# EAGLE design 608_donkey_030000 (EAGLE 9.6.2)
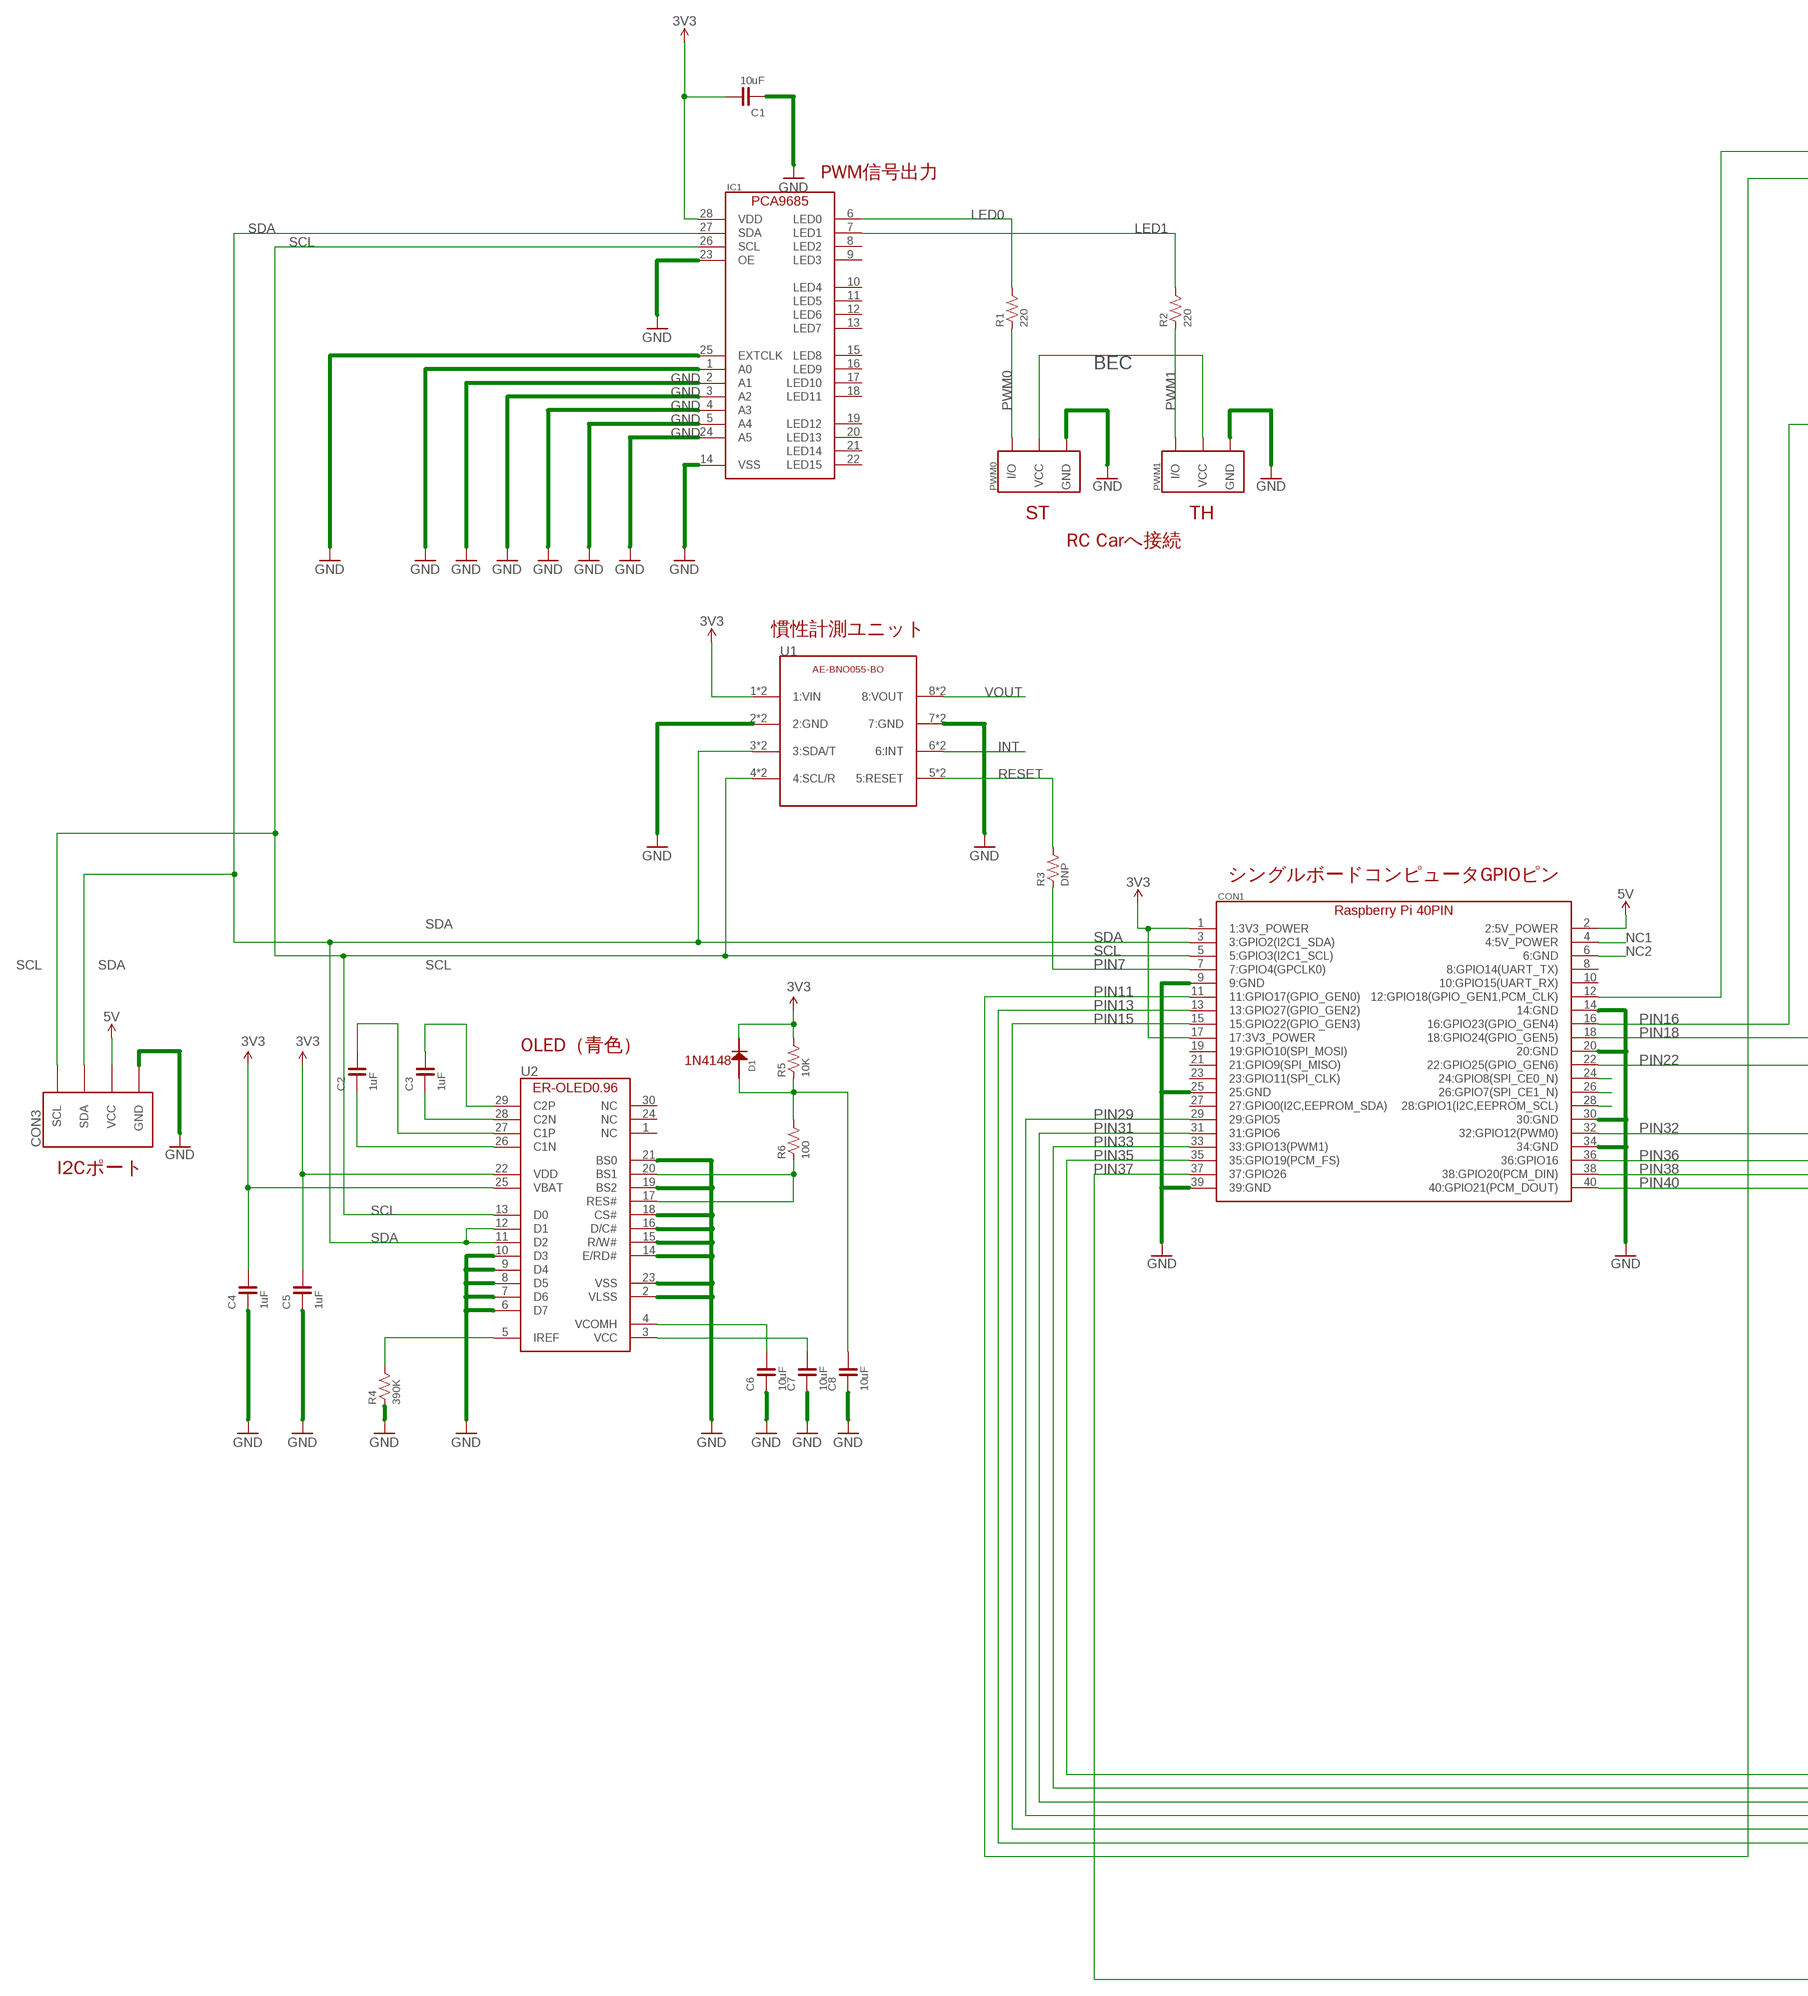
[diagram p0: schematic, sheet 1, part 1 of 3]
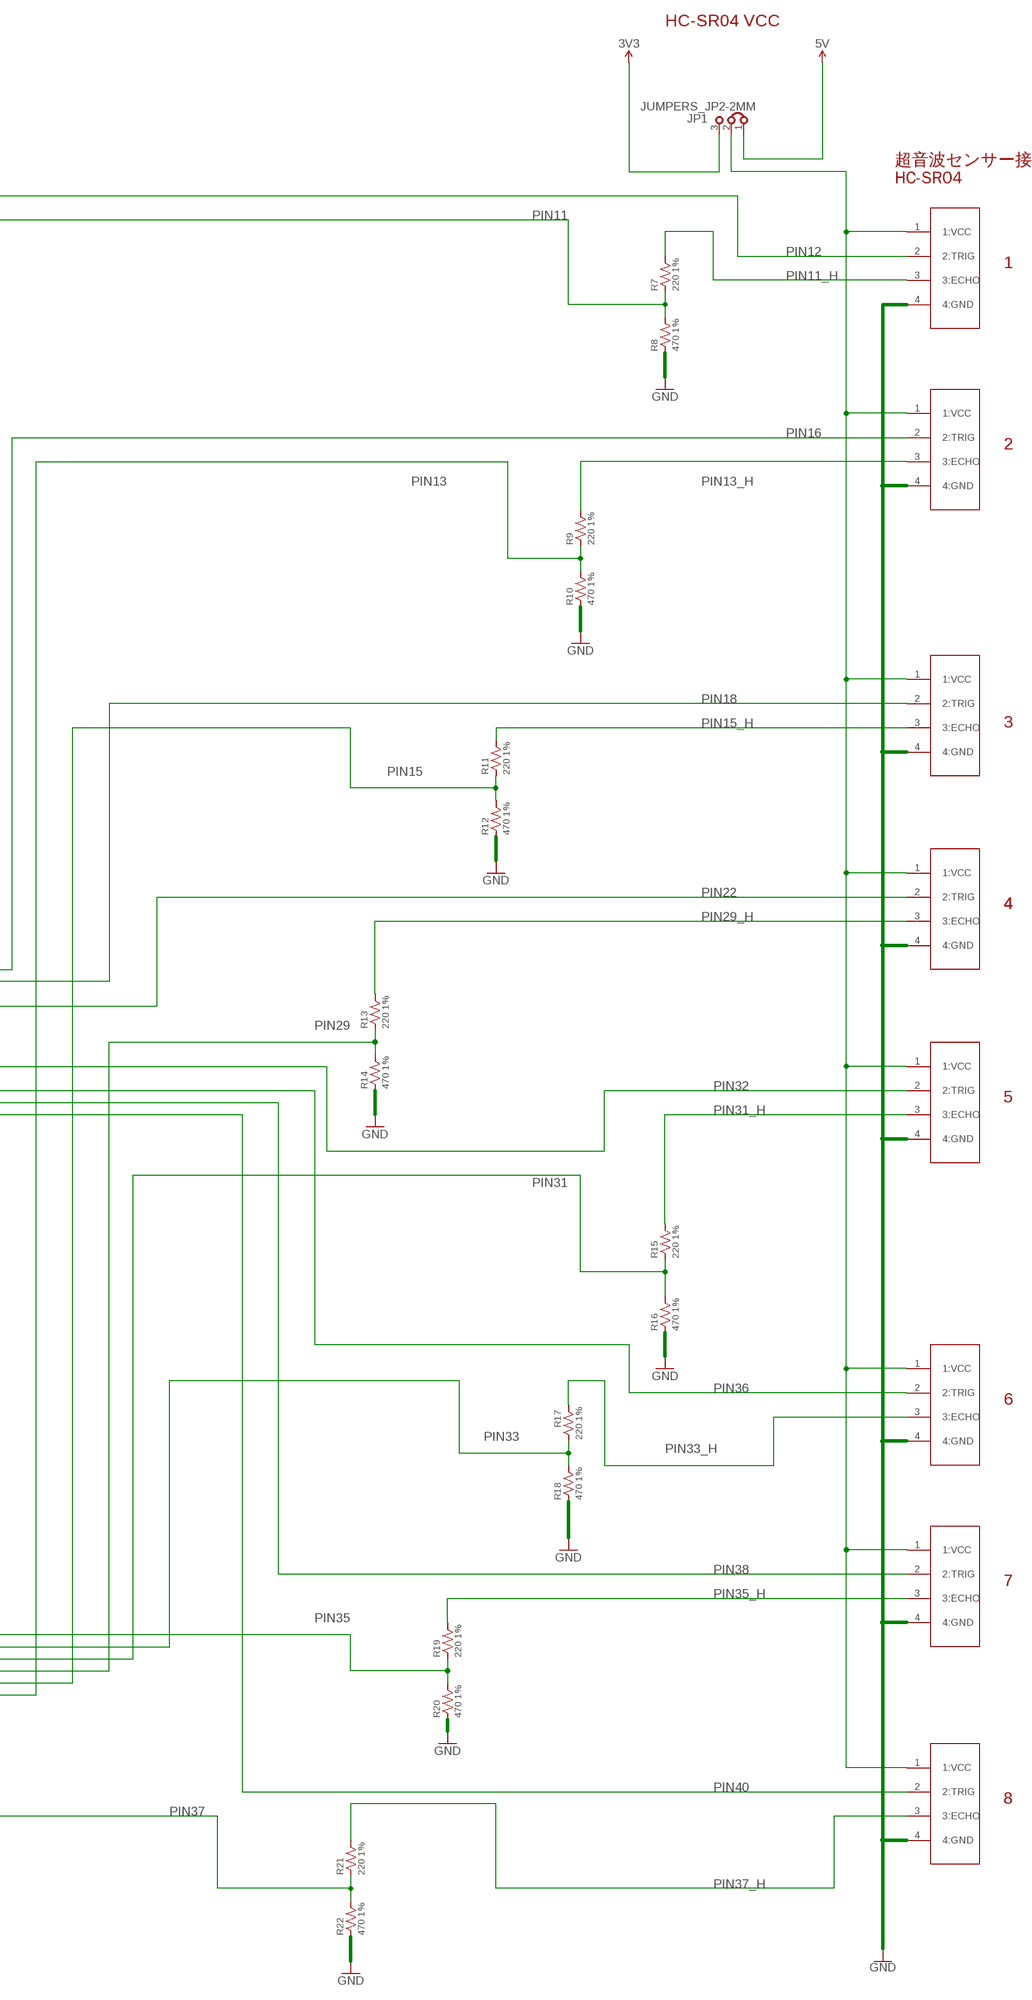
[diagram p1: schematic, sheet 1, part 2 of 3]
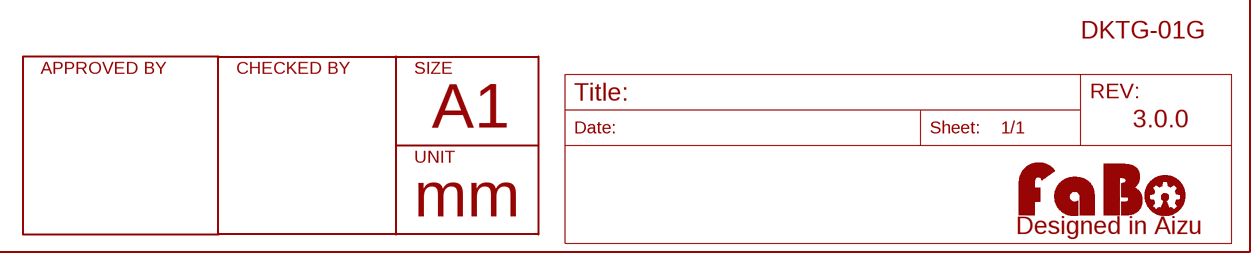
[diagram p2: schematic, sheet 1, part 3 of 3]

## Parts
C1  10uF  CAPACITOR-0603  [0603]
C2  1uF  CAPACITOR-0603-BOTTOM  [0603-BOTTOM]
C3  1uF  CAPACITOR-0603-BOTTOM  [0603-BOTTOM]
C4  1uF  CAPACITOR-0603-BOTTOM  [0603-BOTTOM]
C5  1uF  CAPACITOR-0603-BOTTOM  [0603-BOTTOM]
C6  10uF  CAPACITOR-0603-BOTTOM  [0603-BOTTOM]
C7  10uF  CAPACITOR-0603-BOTTOM  [0603-BOTTOM]
C8  10uF  CAPACITOR-0603-BOTTOM  [0603-BOTTOM]
CON1  RASPBERRYPI_SHEILD  [RASPBERRY_PI_SHILED]
CON3  FABO_BRICK_I2C-S04B-PASK-2  [FABO_BRICK_I2C_S04B-PASK-2]
D1  1N4148  [1N4148W]
HC1  HC-SR04CONHS-SR04CON-SPEACING  [HC-SR04CON-SPEACE]
HC2  HC-SR04CONHS-SR04CON-SPEACING  [HC-SR04CON-SPEACE]
HC3  HC-SR04CONHS-SR04CON-SPEACING  [HC-SR04CON-SPEACE]
HC4  HC-SR04CONHS-SR04CON-SPEACING  [HC-SR04CON-SPEACE]
HC5  HC-SR04CONHS-SR04CON-SPEACING  [HC-SR04CON-SPEACE]
HC6  HC-SR04CONHS-SR04CON-SPEACING  [HC-SR04CON-SPEACE]
HC7  HC-SR04CONHS-SR04CON-SPEACING  [HC-SR04CON-SPEACE]
HC8  HC-SR04CONHS-SR04CON-SPEACING  [HC-SR04CON-SPEACE]
IC1  PCA9685BS  [PCA9685]
JP1  JUMPERS_JP2-2MM  [JUMPERS_JP2-2MM]
LOGO1  LOGO_FABO-M  [LOGO_FABO_M]
PWM0  PWM0  FABO-BRICK-3PIN_HEADER  [PIN_1X3_NARROW]
PWM1  PWM1  FABO-BRICK-3PIN_HEADER  [PIN_1X3_NARROW]
R1  220  RESISTOR-0603  [0603]
R2  220  RESISTOR-0603  [0603]
R3  DNP  RESISTOR-0603-BOTTOM  [0603-BOTTOM]
R4  390K  RESISTOR-0603-BOTTOM  [0603-BOTTOM]
R5  10K  RESISTOR-0603-BOTTOM  [0603-BOTTOM]
R6  100  RESISTOR-0603-BOTTOM  [0603-BOTTOM]
R7  220 1%  RESISTOR-0603  [0603]
R8  470 1%  RESISTOR-0603  [0603]
R9  220 1%  RESISTOR-0603  [0603]
R10  470 1%  RESISTOR-0603  [0603]
R11  220 1%  RESISTOR-0603  [0603]
R12  470 1%  RESISTOR-0603  [0603]
R13  220 1%  RESISTOR-0603  [0603]
R14  470 1%  RESISTOR-0603  [0603]
R15  220 1%  RESISTOR-0603  [0603]
R16  470 1%  RESISTOR-0603  [0603]
R17  220 1%  RESISTOR-0603  [0603]
R18  470 1%  RESISTOR-0603  [0603]
R19  220 1%  RESISTOR-0603  [0603]
R20  470 1%  RESISTOR-0603  [0603]
R21  220 1%  RESISTOR-0603  [0603]
R22  470 1%  RESISTOR-0603  [0603]
U1  AE-BNO055-BO  [DIP_8]
U2  ER-OLED0.96-1ER-CON30HT-1_REV2  [ER-CON30HT-1_REV2]

## Nets
3V3: C1.2 C4.2 C5.2 CON1.1(1:3V3_POWER) CON1.17(17:3V3_POWER) D1.CATHODE IC1.28(VDD) JP1.3 R5.2 U1.1(1:VIN) U1.1-1(1:VIN) U2.22(VDD) U2.25(VBAT)
5V: CON1.2(2:5V_POWER) CON3.VCC JP1.1
BEC: PWM0.2(VCC) PWM1.2(VCC)
GND: C1.1 C4.1 C5.1 C6.1 C7.1 C8.1 CON1.9(9:GND) CON1.14(14:GND) CON1.20(20:GND) CON1.25(25:GND) CON1.30(30:GND) CON1.34(34:GND) CON1.39(39:GND) CON3.GND HC1.4(4:GND) HC2.4(4:GND) HC3.4(4:GND) HC4.4(4:GND) HC5.4(4:GND) HC6.4(4:GND) HC7.4(4:GND) HC8.4(4:GND) IC1.1(A0) IC1.2(A1) IC1.3(A2) IC1.4(A3) IC1.5(A4) IC1.14(VSS) IC1.23(OE) IC1.24(A5) IC1.25(EXTCLK) PWM0.3(GND) PWM1.3(GND) R4.1 R8.1 R10.1 R12.1 R14.1 R16.1 R18.1 R20.1 R22.1 U1.2(2:GND) U1.2-1(2:GND) U1.7(7:GND) U1.7-1(7:GND) U2.2(VLSS) U2.6(D7) U2.7(D6) U2.8(D5) U2.9(D4) U2.10(D3) U2.14(E/RD#) U2.15(R/W#) U2.16(D/C#) U2.18(CS#) U2.19(BS2) U2.21(BS0) U2.23(VSS)
INT: U1.6(6:INT) U1.6-1(6:INT)
LED0: IC1.6(LED0) R1.2
LED1: IC1.7(LED1) R2.2
N$7: C2.1 U2.26(C1N)
N$14: C2.2 U2.27(C1P)
N$19: C3.1 U2.28(C2N)
N$21: C3.2 U2.29(C2P)
N$23: R4.2 U2.5(IREF)
N$24: C6.2 U2.4(VCOMH)
N$25: C7.2 U2.3(VCC)
N$26: R6.1 U2.17(RES#) U2.20(BS1)
N$27: C8.2 D1.ANODE R5.1 R6.2
N$63: CON1.24(24:GPIO8(SPI_CE0_N))
N$65: CON1.26(26:GPIO7(SPI_CE1_N))
N$68: CON1.28(28:GPIO1(I2C,EEPROM_SCL))
NC1: CON1.4(4:5V_POWER)
NC2: CON1.6(6:GND)
PIN7: CON1.7(7:GPIO4(GPCLK0)) R3.1
PIN11: CON1.11(11:GPIO17(GPIO_GEN0)) R7.1 R8.2
PIN11_H: HC1.3(3:ECHO) R7.2
PIN12: CON1.12(12:GPIO18(GPIO_GEN1,PCM_CLK)) HC1.2(2:TRIG)
PIN13: CON1.13(13:GPIO27(GPIO_GEN2)) R9.1 R10.2
PIN13_H: HC2.3(3:ECHO) R9.2
PIN15: CON1.15(15:GPIO22(GPIO_GEN3)) R11.1 R12.2
PIN15_H: HC3.3(3:ECHO) R11.2
PIN16: CON1.16(16:GPIO23(GPIO_GEN4)) HC2.2(2:TRIG)
PIN18: CON1.18(18:GPIO24(GPIO_GEN5)) HC3.2(2:TRIG)
PIN22: CON1.22(22:GPIO25(GPIO_GEN6)) HC4.2(2:TRIG)
PIN29: CON1.29(29:GPIO5) R13.1 R14.2
PIN29_H: HC4.3(3:ECHO) R13.2
PIN31: CON1.31(31:GPIO6) R15.1 R16.2
PIN31_H: HC5.3(3:ECHO) R15.2
PIN32: CON1.32(32:GPIO12(PWM0)) HC5.2(2:TRIG)
PIN33: CON1.33(33:GPIO13(PWM1)) R17.1 R18.2
PIN33_H: HC6.3(3:ECHO) R17.2
PIN35: CON1.35(35:GPIO19(PCM_FS)) R19.1 R20.2
PIN35_H: HC7.3(3:ECHO) R19.2
PIN36: CON1.36(36:GPIO16) HC6.2(2:TRIG)
PIN37: CON1.37(37:GPIO26) R21.1 R22.2
PIN37_H: HC8.3(3:ECHO) R21.2
PIN38: CON1.38(38:GPIO20(PCM_DIN)) HC7.2(2:TRIG)
PIN40: CON1.40(40:GPIO21(PCM_DOUT)) HC8.2(2:TRIG)
PWM0: PWM0.1(I/O) R1.1
PWM1: PWM1.1(I/O) R2.1
RESET: R3.2 U1.5(5:RESET) U1.5-1(5:RESET)
SCL: CON1.5(5:GPIO3(I2C1_SCL)) CON3.SCL IC1.26(SCL) U1.4(4:SCL/R) U1.4-1(4:SCL/R) U2.13(D0)
SDA: CON1.3(3:GPIO2(I2C1_SDA)) CON3.SDA IC1.27(SDA) U1.3(3:SDA/T) U1.3-1(3:SDA/T) U2.11(D2) U2.12(D1)
TR_VCC: HC1.1(1:VCC) HC2.1(1:VCC) HC3.1(1:VCC) HC4.1(1:VCC) HC5.1(1:VCC) HC6.1(1:VCC) HC7.1(1:VCC) HC8.1(1:VCC) JP1.2
VOUT: U1.8(8:VOUT) U1.8-1(8:VOUT)
Unconnected: CON1.8(8:GPIO14(UART_TX)) CON1.10(10:GPIO15(UART_RX)) CON1.19(19:GPIO10(SPI_MOSI)) CON1.21(21:GPIO9(SPI_MISO)) CON1.23(23:GPIO11(SPI_CLK)) CON1.27(27:GPIO0(I2C,EEPROM_SDA)) IC1.8(LED2) IC1.9(LED3) IC1.10(LED4) IC1.11(LED5) IC1.12(LED6) IC1.13(LED7) IC1.15(LED8) IC1.16(LED9) IC1.17(LED10) IC1.18(LED11) IC1.19(LED12) IC1.20(LED13) IC1.21(LED14) IC1.22(LED15) U2.1(NC) U2.24(NC) U2.30(NC)

## Notes on the sheet
- HC-SR04 VCC
- 超音波センサー接続 1~8
  HC-SR04
- PWM信号出力
- 1
- 2
- ST | TH
- RC Carへ接続
- 慣性計測ユニット
- U1
- 3
- シングルボードコンピュータGPIOピン
- 4 | 4
- OLED（青色）
- 1N4148
- I2Cポート | 5
- 6
- 7
- 8
- DKTG-01G
- 3.0.0

## Library data of the parts
C1-C8 = FaBo-Capacitor:CAPACITOR: CAPACITOR
CON1 = FaBo-Boards:RASPBERRYPI_SHEILD
CON3 = FaBo-Template:FABO_BRICK_I2C: FaBo Brick I2C
D1 = FaBo-Diode:1N4148
HC1-HC8 = FaBo-Connetor:HC-SR04CON
IC1 = FaBo-Motor:PCA9685BS
JP1 = 52101-101-REV-A_v16:JUMPERS_JP2-: Jumper/Bridge
LOGO1 = component:LOGO_FABO
PWM0 PWM1 = component:FABO-BRICK-3PIN
R1-R22 = FaBo-Resistors:RESISTOR: RESISTOR
U1 = FaBo-Connetor:AE-BNO055-BO
U2 = FaBo-Display:ER-OLED0.96-1: ER-CON30HT-1 Rev2 wide distance 0.23mm

## Board
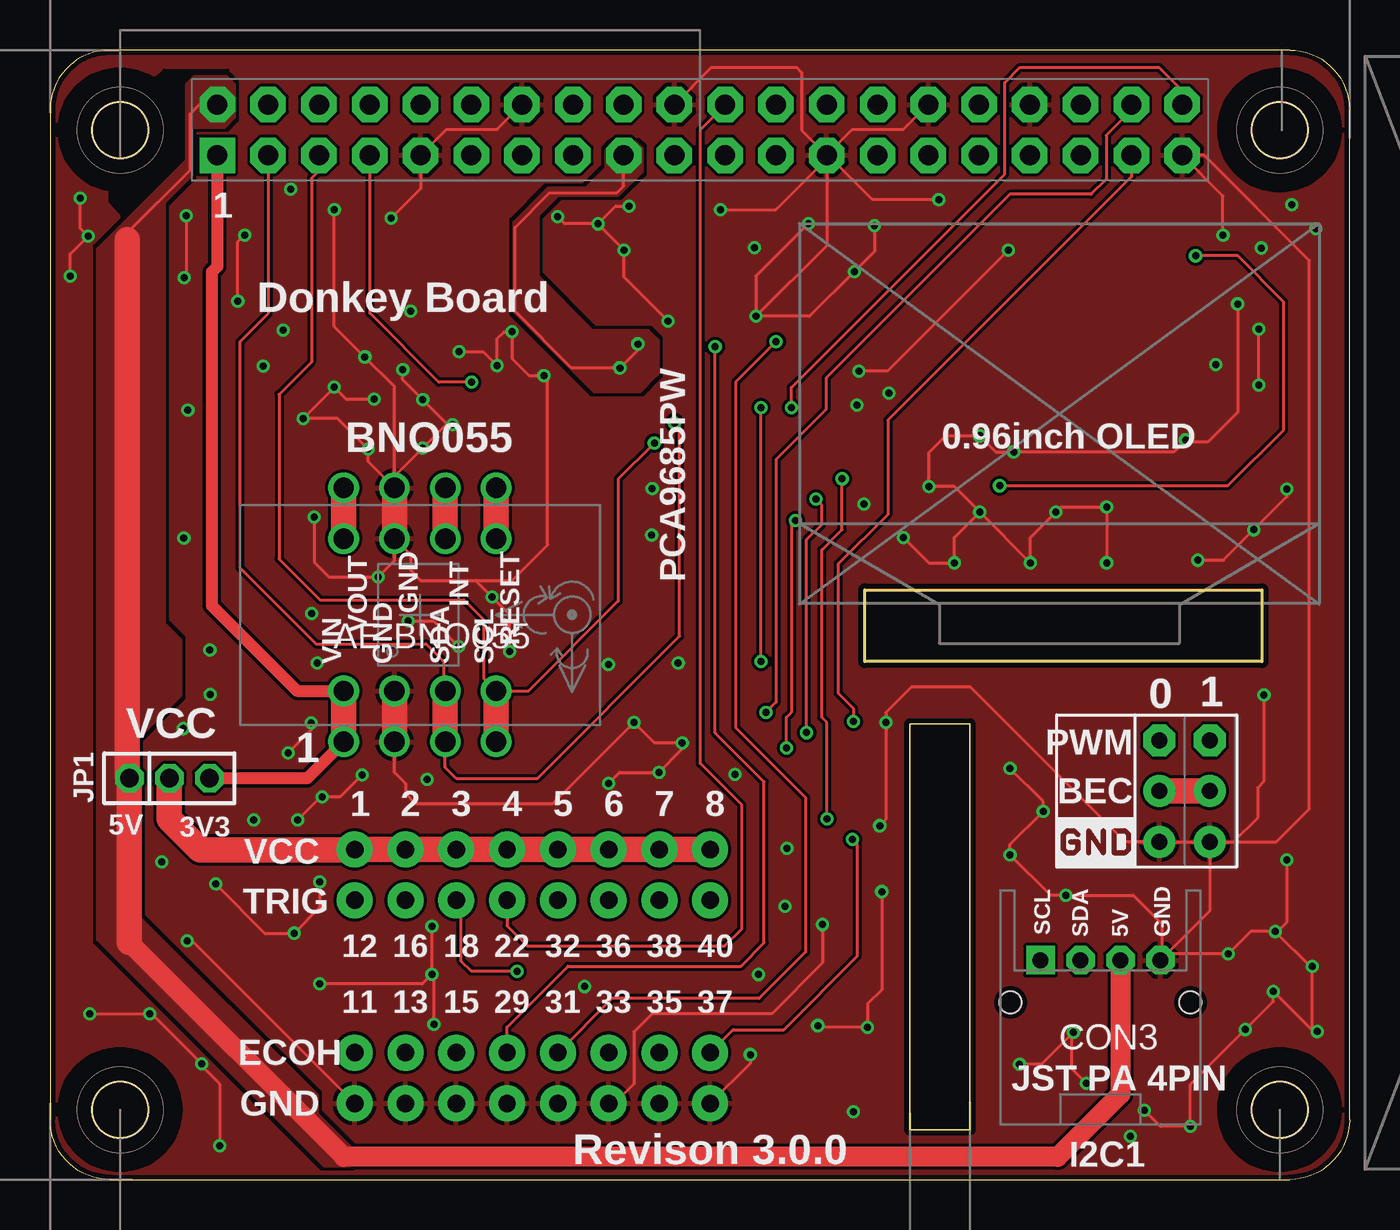
[diagram p3: board, top side]
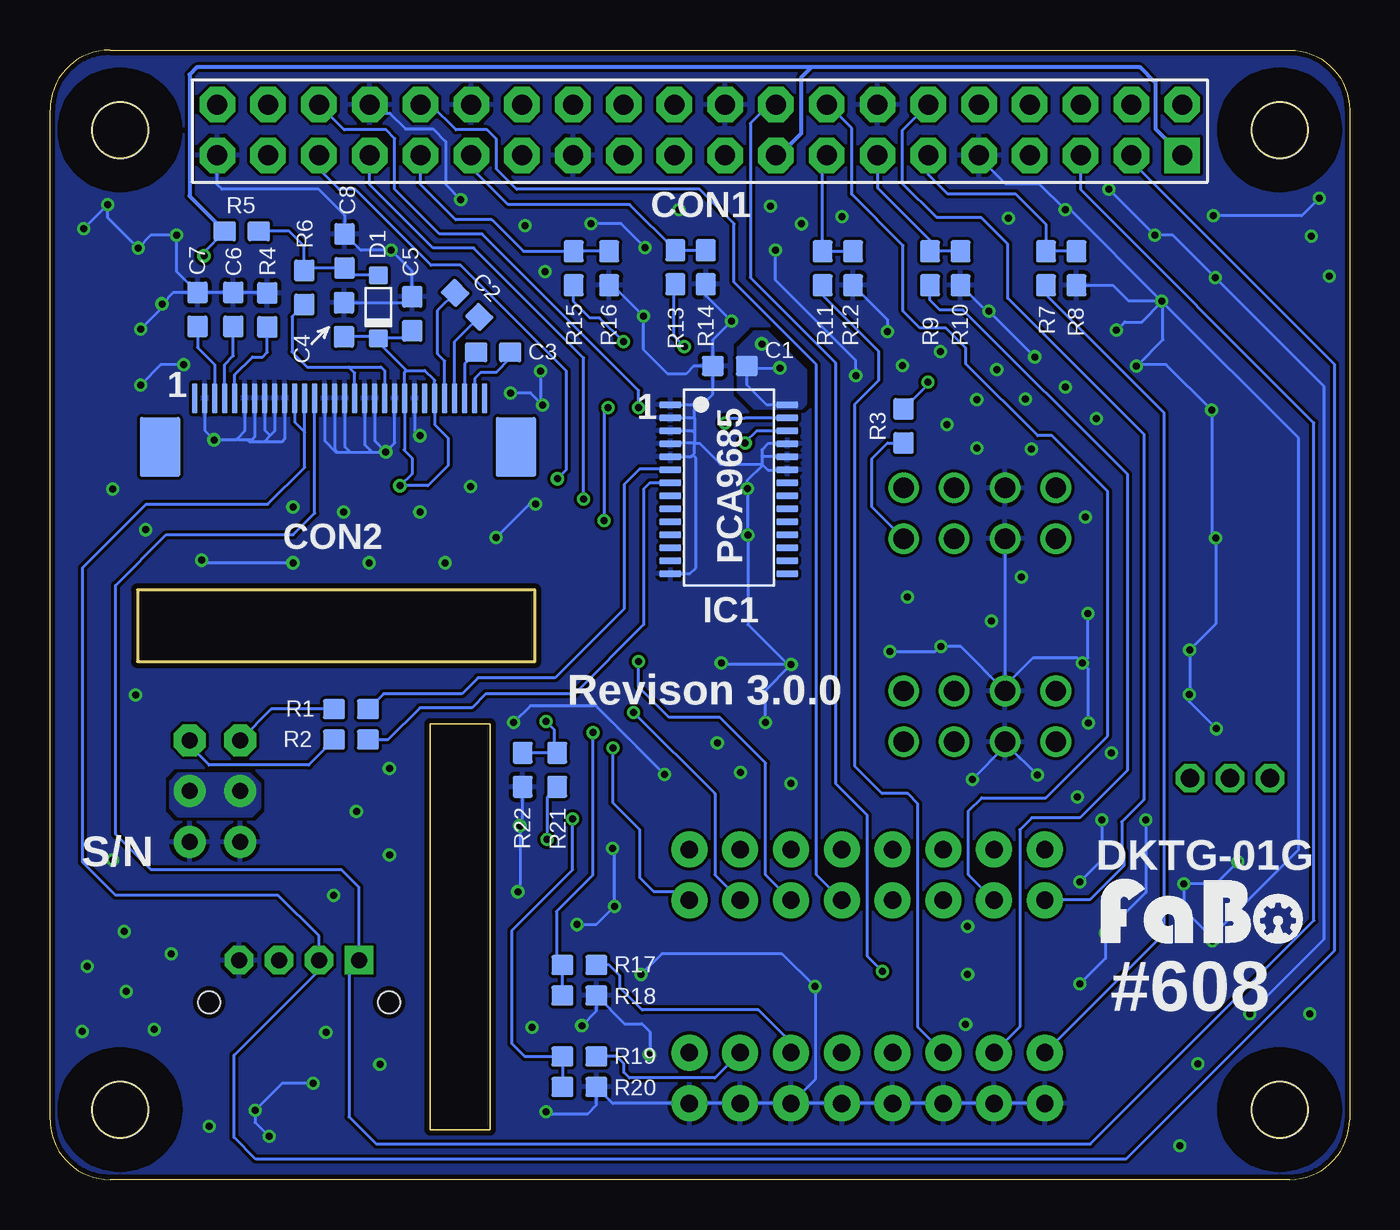
[diagram p4: board, bottom side, seen from below]

Size 65 x 56.5 mm. Coordinates in mm from the lower left corner, seen from the top.
Outline: 40.75,29.5 60.62,29.5 60.62,25.91 40.75,25.91 40.75,29.5
Outline: 43,22.8 46,22.8 46,2.5 43,2.5 43,22.8
Copper layers (1*16): Top 0.035mm / dielectric 1.6mm / Bottom 0.035mm
Design rules "PCBway": minimum track width 6mil, minimum drill 12mil, track to track 6mil, track to pad 6mil, pad to pad 6mil, via to via 6mil, smd to smd 6mil, copper to edge 10mil, drill to drill 10mil, minimum pad ring 10mil, minimum via ring 6mil, stop-mask expansion 2mil, vias tented up to drill 100mil, thermal gap 8mil
Holes 2.8 mm at 3.5,52.5 61.5,52.5 3.5,3.5 61.5,3.5
tRestrict: area 0.4,49.4 to 6.6,55.6; area 58.4,49.4 to 64.6,55.6; area 0.4,0.4 to 6.6,6.6; area 58.4,0.4 to 64.6,6.6; 4 lines
bRestrict: area 0.4,49.4 to 6.6,55.6; area 58.4,49.4 to 64.6,55.6; area 0.4,0.4 to 6.6,6.6; area 58.4,0.4 to 64.6,6.6; 14 lines

### Footprints (pad centres in the part's own frame; a part is rotated, then mirrored left to right if it is on the bottom)
0603 = smd 1.1 x 1: 1 -0.85,0; 2 0.85,0
0603-BOTTOM = smd 1.1 x 1 bottom: 1 -0.85,0; 2 0.85,0
RASPBERRY_PI_SHILED = drill 1 pad 1.778 square: 1 -24.13,-1.27 | drill 1 pad 1.778 octagon: 2 -24.13,1.27; 3 -21.59,-1.27; 4 -21.59,1.27; 5 -19.05,-1.27; 6 -19.05,1.27; 7 -16.51,-1.27; 8 -16.51,1.27; 9 -13.97,-1.27; 10 -13.97,1.27; 11 -11.43,-1.27; 12 -11.43,1.27; 13 -8.89,-1.27; 14 -8.89,1.27; 15 -6.35,-1.27; 16 -6.35,1.27; 17 -3.81,-1.27; 18 -3.81,1.27; 19 -1.27,-1.27; 20 -1.27,1.27; 21 1.27,-1.27; 22 1.27,1.27; 23 3.81,-1.27; 24 3.81,1.27; 25 6.35,-1.27; 26 6.35,1.27; 27 8.89,-1.27; 28 8.89,1.27; 29 11.43,-1.27; 30 11.43,1.27; 31 13.97,-1.27; 32 13.97,1.27; 33 16.51,-1.27; 34 16.51,1.27; 35 19.05,-1.27; 36 19.05,1.27; 37 21.59,-1.27; 38 21.59,1.27; 39 24.13,-1.27; 40 24.13,1.27
FABO_BRICK_I2C_S04B-PASK-2 = drill 0.8 pad 1.422 octagon: GND -3,0; SDA 1,0; VCC -1,0 | drill 0.8 pad 1.422 square: SCL 3,0 | hole 1.1: 4.5,2.1; -4.5,2.1
1N4148W = smd 0.9 x 0.95: ANODE 0,0; CATHODE 3.15,0
HC-SR04CON-SPEACE = drill 0.87 pad 1.8: 1 -6.35,0; 2 -3.81,0; 3 3.81,0; 4 6.35,0
PCA9685 = smd 0.3 x 1.1: 1 -4.15,-2.93; 2 -3.5,-2.93; 3 -2.85,-2.93; 4 -2.2,-2.93; 5 -1.55,-2.93; 6 -0.9,-2.93; 7 -0.25,-2.93; 8 0.4,-2.93; 9 1.05,-2.93; 10 1.7,-2.93; 11 2.35,-2.93; 12 3,-2.93; 13 3.65,-2.93; 14 4.3,-2.93; 15 4.3,2.92; 16 3.65,2.92; 17 3,2.92; 18 2.35,2.92; 19 1.7,2.92; 20 1.05,2.92; 21 0.4,2.92; 22 -0.25,2.92; 23 -0.9,2.92; 24 -1.55,2.92; 25 -2.2,2.92; 26 -2.85,2.92; 27 -3.5,2.92; 28 -4.15,2.92
JUMPERS_JP2-2MM = drill 0.914 octagon: 1 -2,0; 2 0,0; 3 2,0
PIN_1X3_NARROW = drill 0.8 pad 1.6 octagon: 1 -2.54,0 | drill 0.8 pad 1.6: 2 0,0; 3 2.54,0
DIP_8 = drill 1.02: 1 -3.81,-3.81; 1-1 -3.81,-6.35; 2 -1.27,-3.81; 2-1 -1.27,-6.35; 3 1.27,-3.81; 3-1 1.27,-6.35; 4 3.81,-3.81; 4-1 3.81,-6.35; 5 3.81,3.81; 5-1 3.81,6.35; 6 1.27,3.81; 6-1 1.27,6.35; 7 -1.27,3.81; 7-1 -1.27,6.35; 8 -3.81,3.81; 8-1 -3.81,6.35
ER-CON30HT-1_REV2 = smd 0.27 x 1.5 bottom: 1 7,-0.23; 2 6.5,-0.23; 3 6,-0.23; 4 5.5,-0.23; 5 5,-0.23; 6 4.5,-0.23; 7 4,-0.23; 8 3.5,-0.23; 9 3,-0.23; 10 2.5,-0.23; 11 2,-0.23; 12 1.5,-0.23; 13 1,-0.23; 14 0.5,-0.23; 15 0,-0.23; 16 -0.5,-0.23; 17 -1,-0.23; 18 -1.5,-0.23; 19 -2,-0.23; 20 -2.5,-0.23; 21 -3,-0.23; 22 -3.5,-0.23; 23 -4,-0.23; 24 -4.5,-0.23; 25 -5,-0.23; 26 -5.5,-0.23; 27 -6,-0.23; 28 -6.5,-0.23; 29 -7,-0.23; 30 -7.5,-0.23 | smd 2 x 3 bottom: 31 -9.07,-2.67; 32 8.74,-2.67

### Placement (x,y rotation side)
C1  30.99,40.69 0 bottom
C2  44.14,43.75 225 top
C3  42.83,41.38 180 top
C4  50.29,43.01 270 top
C5  46.88,43.31 270 top
C6  55.83,43.52 270 top
C7  57.62,43.52 270 top
C8  50.27,46.44 270 top
CON1  32.5,52.5 0 top
CON3  52.55,10.97 180 top
D1  48.58,45.23 270 bottom
HC1  15.24,10.16 270 top
HC2  17.78,10.16 270 top
HC3  20.32,10.16 270 top
HC4  22.86,10.16 270 top
HC5  25.4,10.16 270 top
HC6  27.94,10.16 270 top
HC7  30.48,10.16 270 top
HC8  33.02,10.16 270 top
IC1  31.04,34.6 270 bottom
JP1  5.97,20.07 0 top
LOGO1  7.38,11.43 0 bottom
PWM0  55.48,19.43 270 top
PWM1  58.02,19.43 270 top
R1  49.94,23.53 0 bottom
R2  49.94,22.01 0 bottom
R3  22.31,37.69 270 top
R4  54.13,43.49 270 top
R5  55.41,47.43 0 top
R6  52.29,44.62 90 top
R7  15.18,45.58 270 bottom
R8  13.66,45.58 90 bottom
R9  20.98,45.58 270 bottom
R10  19.46,45.58 90 bottom
R11  26.36,45.58 270 bottom
R12  24.83,45.58 90 bottom
R13  33.72,45.64 270 bottom
R14  32.2,45.64 90 bottom
R15  38.8,45.58 270 bottom
R16  37.03,45.58 90 bottom
R17  38.52,10.73 0 bottom
R18  38.52,9.2 180 bottom
R19  38.52,6.15 0 bottom
R20  38.52,4.63 180 bottom
R21  39.63,20.49 270 bottom
R22  41.35,20.49 90 bottom
U1  18.5,28.25 0 top
U2  50.76,39.31 0 top
U$3  [LOGO_SILK_GND]  50.4,15.62 0 top

### Tracks (layer width: path | path; a pad name or v marks a point on that pad's centre or on a via)
3V3  (via drill 0.35)
  Top 0.152: v47.5,34.7 58.9,34.7 61.7,37.5 61.7,43.9 59.4,46.2 v57.3,46.2 | CON1.17 28.69,49.69 28.35,49.35 24.98,49.35 23.25,47.62 23.25,43.44 26.09,40.6 v28.5,40.6 29.4,41.5 v29.4,41.8
  Top 0.61: U1.1-1 12.86,20.07 JP1.3 | CON1.1 8.37,45.67 8.09,45.39 8.09,28.71 12.36,24.44 U1.1
  Top 1.27: U1.1 U1.1-1
  Bottom 0.152: v57.3,46.2 57.3,46.39 R5.2 | D1.CATHODE 48.58,41.88 47.17,40.47 | IC1.28 29.15,38.75 30.14,39.74 C1.2 30.05,40.6 v28.5,40.6 | 47.17,40.47 46.25,40.47 45.76,39.98 U2.25 45.76,37.76 45.1,37.1 45.1,35.7 46.1,34.7 v47.5,34.7 46.9,35.3 46.9,36.1 47.3,36.5 47.26,36.54 U2.22 47.26,40.38 47.17,40.47 | C5.2 47.26,42.08 D1.CATHODE | D1.CATHODE 48.66,42.16 C4.2
  Bottom 0.203: CON1.1 9.7,52.56 9.7,54.86 10.47,55.63 26.92,55.63 | 26.92,55.63 27.43,55.12 27.43,52.32 28.53,51.23 CON1.17 | 26.92,55.63 57.66,55.63 58.02,55.26 58.02,49.2 R5.2
  pour Bottom (rank 3, no thermals): 27.2,38.8 27.2,40.5 29.1,42.4 29.8,42.4 30.6,41.6 30.6,39.4 29.8,38.6 27.4,38.6
  pour Top (no thermals): 28.8,42.5 29.9,42.5 30.4,42 30.4,40.3 30.3,40.2 29.5,39.4 27.2,39.4 23.2,43.4 23.2,43.5 23.2,47.9 24.9,49.6 26.8,49.6 27.8,50.6 27.8,51.1 27.8,51.5 28,51.7 28.2,51.9 29.1,51.9 29.3,51.9 29.6,51.6 29.6,50.9 29.6,50.4 28.4,49.2 25.4,49.2 25.3,49.1 24.4,48.2 24.4,47.6 24.4,45.2 27.1,42.5
5V
  Top 0.152: 3.87,47.01 3.87,47.37 7,50.5 7,53.3 7.47,53.77 CON1.2
  Top 1: CON3.VCC 53.55,4.27 50.41,1.13 14.71,1.13 3.97,11.87
  Top 1.27: 3.87,47.01 3.87,20.17 JP1.1 3.97,11.87
  pour Top (no thermals): 6.8,50.98 2.36,46.54 2.36,12.01 13.69,0.68 15.03,0.68 15.03,1.63 13.38,3.28 13.38,4.24 4.42,13.2 4.42,22.07 6.57,24.22 6.57,26.98 5.73,27.82 5.73,48.86 7.12,50.25 7.12,52.65 8.76,52.65 9.24,53.13 9.24,54.78 8.85,55.17 7.19,55.17 6.8,54.78
BEC
  Top 1.27: PWM0.2 PWM1.2
  pour Bottom (no thermals): 54.5,18.6 54.5,19.8 55,20.3 58.6,20.3 59,19.9 59,18.6 58.6,18.2 54.9,18.2
GND  (via drill 0.35)
  Top 0.152: v14.22,48.51 14.22,42.67 v15.75,41.15 17.23,39.67 U1.7-1 | CON1.14 22.37,52.53 19.83,52.53 CON1.9 18.53,49.55 v17.06,48.08 | 21.28,29.97 18.54,29.97 18.03,30.48 18.03,31.26 17.25,32.05 | 21.28,29.97 23.11,29.97 24.89,31.75 24.89,40.03 v24.7,40.22 23.95,40.22 23.11,41.06 23.11,42.4 | U1.7 17.25,32.05 | CON1.25 38.9,51.27 | 38.9,51.27 40.15,52.53 42.69,52.53 CON1.30 | CON1.25 38.85,51.05 | 38.85,51.05 38.85,46.72 v35.31,43.18 | v33.53,48.51 36.31,48.51 38.85,51.05 | CON1.20 33.09,55.63 37.34,55.63 37.59,55.37 37.59,52.49 CON1.25 | PWM1.3 PWM0.3 53.78,16.89 46.04,24.64 43.09,24.64 41.81,23.36 v41.81,22.86 41.81,18.01 v41.5,17.7 | PWM1.3 58.02,13.45 CON3.GND | PWM1.3 59.19,16.89 | 59.19,16.89 61.34,16.89 62.99,18.54 62.99,45.97 57.74,51.23 56.64,51.23 | 56.64,51.23 CON1.39 | v58.67,47.24 58.67,49.2 56.64,51.23 | v44.45,49.02 41.15,49.02 38.9,51.27 | HC1.4 7.11,11.94 v6.86,11.94 | U1.2-1 17.23,20.36 17.78,19.81 17.78,19.3 18.29,18.8 25.15,18.8 v29.21,22.86 30.23,21.84 v31.62,21.84 31.62,21.54 v30.45,20.37 28.5,20.37 v27.94,19.81 | v59.4,43.8 59.4,38.4 57.9,36.9 56.9,36.9 v56.8,37 56.2,36.4 v48.2,36.4 47.3,36.4 v46.5,37.2 44.8,37.2 43.96,36.36 v43.96,34.66 45.23,34.66 v46.5,33.39 | v30.92,42.93 28.71,45.14 v28.71,46.48 27.41,47.78 v27.41,47.8 | v23.11,42.42 23.11,42.4 | v47.93,46.48 41.89,40.44 v40.46,40.44 | v41.6,14.4 41.6,9.5 40.89,8.79 v40.89,7.62 38.48,7.62 v38.4,7.7 | v6.82,48.21 6.82,45.21 v6.72,45.11 | v9.4,43.94 9.4,46.91 v9.73,47.24 | v8.28,14.78 10.74,12.32 v12.2,12.32 | v12.2,12.32 v12.21,12.32 | v1.98,8.28 v4.98,8.28 5.08,8.28 v7.58,5.78 7.58,5.68 8.48,4.78 v8.48,1.68
  Top 0.152: v19.2,7.76 19.2,10.16 v19.1,10.26 | v19.1,10.26 v19.1,12.66 | v19.1,10.26 18.62,9.78 v13.48,9.78 | v35.03,6.25 35.03,5.82 HC8.4 | v38.65,12.75 38.65,10.85 36.1,8.3 30.1,8.3 29.2,7.4 29.2,4.8 28.21,3.81 HC6.4 | v51.2,7.36 51.12,7.28 | 51.12,7.28 49.6,5.75 v48.5,5.75 | v51.83,4.82 51.12,5.53 51.12,7.28 | v54.74,3.46 55.54,2.66 v57.04,2.66 57.04,4.75 v59.79,7.5 61.19,8.9 v61.19,9.4 63.19,7.4 v63.39,7.4 63.14,7.65 v63.14,10.66 63.03,10.66 61.34,12.35 | 61.34,12.35 v61.29,12.4 60.05,12.4 v58.95,11.29 55.87,11.29 CON3.GND | v61.87,15.99 61.87,12.87 61.34,12.35 | CON3.GND 55.6,11.02 55.6,12.8 54.19,14.21 v50.82,14.21 50.06,14.21 v48.02,16.25 48.02,16.75 v49.67,18.4 49.67,18.91 v48.02,20.56 | v60.72,24.25 60.72,19.92 60.4,19.6 60.4,18.1 59.19,16.89 | v42.69,32.12 43.96,30.85 v45.23,30.85 45.23,32.12 v46.5,33.39 | v46.5,33.39 v49.04,30.85 49.04,32.12 v50.31,33.39 50.56,33.64 v52.85,33.64 v52.85,30.85 | v57.42,30.98 58.69,30.98 v60.22,32.5 61.87,34.15 v61.87,34.53 | v60.47,39.74 v60.47,42.53 | v41.23,47.71 41.23,46.41 v40.23,45.41 37.99,43.18 v35.31,43.18 | v37.93,47.81 35.31,45.19 v35.31,43.18 | v27.41,47.8 28.3,48.69 v28.96,48.69 | v27.41,47.8 25.75,47.8 v25.39,48.16 | v20.46,41.41 21.66,41.41 v22.36,40.71 22.36,42.06 22.7,42.4 23.11,42.4 | v17.65,40.51 17.65,40.01 v18.65,39.01 19.89,37.77 v20.13,37.77 19.82,37.77 v18.63,36.58 17.23,35.18 U1.7-1 | U1.7-1 15.92,35.91 v15.92,36.53 14.39,38.06 v12.66,38.06 v14.22,39.62 v14.22,39.63 14.82,39.03 v16.22,39.03 | v15.62,20.24 14.52,19.14 v13.62,19.14 13.54,19.14 v12.38,17.98 | v13.06,22.83 13.06,22.48 v11.92,21.34 | v13.48,14.88 13.48,13.6 v12.2,12.32
  Top 0.152: v13.22,33.13 13.22,30.88 13.97,30.13 v16.42,30.13 17.25,30.96 17.25,32.05 | v17.92,27.93 19.18,27.93 v20.45,26.67 | v22.99,26.42 22.99,28.26 v22.12,29.13 21.28,29.97 | v1.01,45.19 1.01,46.29 v1.91,47.19 1.51,47.59 v1.51,49.09
  Top 1.27: U1.2 U1.2-1 | U1.7 U1.7-1
  Bottom 0.152: HC1.4 HC2.4 HC3.4 HC4.4 HC5.4 HC6.4 | HC6.4 HC7.4 HC8.4 36.85,3.81 R20.1 37.67,3.73 38.1,3.3 40.1,3.3 v40.18,3.38 | U1.7 17.23,24.7 | 17.23,24.7 U1.2 19.45,26.66 20.46,26.66 | IC1.1 32.77,38.75 | 32.77,38.75 32.37,38.75 31.84,39.28 C1.1 | 32.77,36.83 32.51,36.83 31.5,35.82 31.5,35.8 29.4,35.8 | 32.77,36.83 33.94,36.83 IC1.4 | IC1.2 32.77,38.1 | 32.77,38.1 32.77,38.75 | 32.77,38.1 32.77,37.34 | 32.77,37.34 32.77,36.83 | IC1.3 32.88,37.45 32.77,37.34 | IC1.5 32.94,36.15 32.84,36.24 | 32.84,36.24 32.77,36.32 32.77,36.83 | R4.1 54.15,44.37 C6.1 C7.1 | CON1.39 56.63,49.77 56.39,49.53 51.56,49.53 50.27,48.24 C8.1 49.46,46.48 v47.93,46.48 46.88,45.43 C5.1 47.17,43.86 C4.1 | C7.1 58.67,45.42 v58.67,47.24 59.95,47.24 v60.6,46.6 62.12,48.12 v62.12,48.76 v63.32,47.56 | CON1.34 48.58,53.34 48.01,53.34 47.22,52.55 45.85,52.55 45.21,51.92 45.21,49.78 v44.45,49.02 | v6.86,11.94 6.86,12.1 | 6.86,12.1 6.86,12.19 2.54,16.51 2.54,37.08 9.33,43.87 | 9.33,43.87 v9.4,43.94 | 32.84,36.24 32.7,36.1 32.7,30.6 33,30.3 IC1.14 | IC1.25 29.1,36.8 29.4,36.5 29.4,36.2 | 29.4,36.2 29.4,35.8 | 29.4,35.8 29.35,35.75 | 29.35,35.75 29.1,35.5 IC1.23 | IC1.24 29.35,36.15 29.4,36.2 | C1.1 32.81,40.69 33.2,40.3 34.1,40.3 35.31,41.51 v35.31,43.18 36.86,44.73 R16.1 | v46.5,37.2 46.76,37.46 U2.23 | v48.2,36.4 48.76,36.96 U2.19 | 48.9,36.4 v48.2,36.4 | 48.9,36.4 49.26,36.76 U2.18 | 50,36.4 50.26,36.66 U2.16 | 50,36.4 48.9,36.4 | 50.63,36.4 50.7,36.4 51.26,36.96 U2.14 | 50.63,36.4 50,36.4 | 55.65,37.05 55.7,37 v56.8,37 57.26,37.46 U2.2 | 55.1,37 54.9,37 54.76,37.14 U2.7 | 55.1,37 55.6,37 55.65,37.05 | 54.3,36.9 55,36.9 55.1,37 | 54.3,36.9 53.4,36.9 53.26,37.04 U2.10
  Bottom 0.152: C7.1 58.83,44.37 v59.4,43.8 59.4,43.6 v60.47,42.53 | C1.1 31.84,42.01 v30.92,42.93 32.2,44.21 R14.1 | v24.7,40.22 24.7,40.97 28.71,44.98 v28.71,46.48 | v29.21,22.86 29.21,24.47 v27.93,25.76 28.1,25.76 | v9.4,43.94 9.43,43.97 | 9.43,43.97 13.97,48.51 v14.22,48.51 15.51,49.8 17.2,49.8 18.53,51.13 CON1.9 | R8.1 11.83,44.73 11.07,43.97 9.43,43.97 | R10.1 18.16,43.43 v18.03,43.43 v15.75,41.15 | R12.1 23.11,43.01 v23.11,42.42 | R22.1 41.35,17.85 v41.5,17.7 41.5,14.5 v41.6,14.4 | v35.03,6.25 35,6.28 35,7.4 35.4,7.8 36.27,7.8 R18.1 37.67,8.43 v38.4,7.7 | v1.51,49.09 2.39,48.21 v6.82,48.21 | v10.66,40.68 10.57,40.77 | 10.57,40.77 9.33,42.01 9.33,43.87 | v11.66,42.48 11.24,42.9 10.4,42.9 9.4,43.9 v9.4,43.94 | 10.57,40.77 9.18,40.77 v6.9,38.49 6.9,32.29 v6.7,32.09 6.7,27.79 v8,26.49 8,24.28 v8.02,24.26 8.02,23.91 v6.66,22.55 | v10.18,17.98 10.18,14.35 v12.21,12.32 12.21,11.05 v13.48,9.78 | v5.58,15.88 6.68,14.78 v8.28,14.78 8.28,13.52 6.86,12.1 | v4.98,8.28 4.98,8.32 1.27,12.03 1.27,39.67 v6.72,45.11 8.85,47.24 v9.73,47.24 v12.03,49.54 | HC6.4 26.7,5.05 26.7,9.61 v26.75,9.65 28.39,11.3 34.4,11.3 v35.45,10.25 | v38.65,12.75 37.67,12.75 v36.76,13.67 36.76,16.47 v36.85,16.57 | 28.1,25.76 31.34,25.76 v31.42,25.84 | 28.1,25.76 30.1,27.75 v30.1,32.23 30.1,34.54 v30.12,34.57 30.12,34.98 29.35,35.75 | v34.26,20.27 37.68,23.7 40.97,23.7 v41.81,22.86 | v51.83,4.82 53.38,4.82 v54.74,3.46 54.74,2.86 v54.04,2.16 | v42.69,32.12 41.01,33.8 v40.71,33.8 | v52.85,30.85 57.3,30.85 v57.42,30.98 | v58.31,40.76 59.45,40.76 v60.47,39.74 | v13.36,25.83 13.08,26.11 v13.08,28.32 | v13.36,25.83 13.63,26.1 15.83,26.1 17.23,24.7
  Bottom 0.152: v13.06,22.83 13.06,25.53 v13.36,25.83 | v40.46,40.44 40.46,38.84 v40.36,38.74 40.96,39.34 v41.96,39.34 | v22.99,26.42 20.7,26.42 20.46,26.66 | 20.46,26.66 v20.45,26.67 | v18.87,20.02 17.23,21.66 17.23,21.7 | 17.23,21.7 U1.2-1 | v15.62,20.24 17.08,21.7 17.23,21.7 | v12.38,17.98 12.38,15.98 v13.48,14.88 | v35.23,46.61 36.43,47.81 v37.93,47.81 | U2.21 47.76,36.84 v48.2,36.4 | U2.9 53.76,37.44 53.99,37.21 | 53.99,37.21 54.3,36.9 | U2.8 54.26,37.48 53.99,37.21 | U2.6 55.26,37.44 55.65,37.05 | U2.15 50.76,36.53 50.63,36.4
  pour Bottom (rank 6): -10.2,66.1 88.9,66.1 88.9,-20.7 -10.2,-20.7
  pour Top (rank 6): -10.7,66.3 89.5,66.3 89.5,-21.21 -10.7,-21.21
INT
  Top 1.27: U1.6-1 U1.6
LED0
  Bottom 0.152: IC1.6 34.03,35.56 35.5,35.56 36.27,34.78 36.27,28.57 39.74,25.1 43.6,25.1 44.4,24.3 48.32,24.3 R1.2
LED1
  Bottom 0.152: IC1.7 35,34.85 35.31,34.54 35.31,27.76 38.76,24.3 43.2,24.3 43.9,23.6 46.5,23.6 48.09,22.01 R2.2
N$7
  Bottom 0.152: C2.1 45.61,43.48 45.61,41.29 45.26,40.94 U2.26
N$14
  Bottom 0.152: C2.2 44.76,41.92 U2.27
N$19
  Bottom 0.152: C3.1 44.26,40.8 U2.28
N$21
  Bottom 0.152: C3.2 41.98,41.08 42.67,40.39 43.43,40.39 43.76,40.06 U2.29
N$23
  Bottom 0.152: R4.2 54.13,41.38 54.36,41.15 54.86,41.15 55.76,40.25 U2.5
N$24
  Bottom 0.152: C6.2 55.83,41.2 56.26,40.77 56.26,40.76 U2.4
N$25
  Bottom 0.152: C7.2 57.62,41.62 56.76,40.76 U2.3
N$26
  Bottom 0.152: 50.06,40.64 48.44,40.64 48.26,40.46 U2.20 | R6.1 52.9,43.15 52.9,41.4 52.14,40.64 50.06,40.64 | U2.17 49.76,40.34 50.06,40.64
N$27
  Bottom 0.152: D1.ANODE 49.9,45.23 C8.2 52.16,45.59 R6.2 52.29,46.69 53.03,47.43 R5.1
PIN7  (via drill 0.35)
  Top 0.152: CON1.7 16,43.33 19.45,39.88 v21.08,39.88
  Bottom 0.152: R3.1 21.08,39.77 v21.08,39.88
PIN11
  Bottom 0.152: CON1.11 21.07,50.27 20.1,49.3 16.7,49.3 15.18,47.78 R7.1 R8.2
PIN11_H
  Bottom 0.152: HC1.3 9.3,12.29 9.3,38.37 15.18,44.25 R7.2
PIN12
  Bottom 0.152: HC1.2 15.24,14 13,14 11.3,15.7 11.3,16.4 11.4,16.5 11.4,17.9 10.3,19 10.3,37.29 17.09,44.08 17.09,46.79 18.42,48.12 20.65,48.12 22.35,49.82 22.35,52.49 CON1.12
PIN13
  Bottom 0.152: CON1.13 23.61,49.61 20.98,46.98 R9.1 R10.2
PIN13_H
  Bottom 0.152: HC2.3 16.5,7.63 16.5,17.5 15.9,18.1 13.5,18.1 11.1,20.5 11.1,35.27 19.33,43.5 20.5,43.5 21,44 21,44.72 R9.2
PIN15
  Bottom 0.152: CON1.15 26.36,51.02 R11.1 R12.2
PIN15_H
  Bottom 0.152: HC3.3 21.59,7.62 21.59,18.8 22.1,19.3 23.38,19.3 24.73,20.66 24.73,38.79 23.54,39.98 23.54,41.42 26.36,44.24 R11.2
PIN16
  Bottom 0.152: HC2.2 19.05,15.24 19.05,18.45 18.4,19.1 15.2,19.1 12.1,22.2 12.1,34.42 14.88,37.2 15.6,37.2 19.2,40.8 19.2,41.6 20.2,42.6 21.48,42.6 22.33,43.45 22.33,46.71 24.89,49.28 24.89,52.58 26.08,53.77 CON1.16
PIN18  (via drill 0.35)
  Top 0.152: v23.37,10.41 21.08,10.41 20.57,10.92 20.57,13.72 HC3.2
  Bottom 0.152: CON1.18 29.03,53.77 29.97,52.83 29.97,45.12 25.71,40.86 25.71,19.81 24.13,18.23 24.13,11.18 v23.37,10.41
PIN22
  Top 0.152: HC4.2 22.86,12.7 23.88,11.68 33.74,11.68 34.61,12.55 34.61,18.73 32.54,20.8 32.54,52.51 33.77,53.74 CON1.22
PIN29
  Bottom 0.152: CON1.29 43.93,50.61 42.09,48.77 36.01,48.77 R13.1 R14.2
PIN29_H  (via drill 0.35)
  Top 0.152: HC4.3 22.86,7.62 25.91,10.67 34.55,10.67 35.72,11.84 35.72,19.9 33.27,22.34 v33.27,41.66
  Bottom 0.152: R13.2 33.82,44.69 33.82,42.21 v33.27,41.66
PIN31
  Bottom 0.152: CON1.31 46.47,49.77 44.7,48.01 42.89,48.01 41.32,46.43 R15.1 38.6,46.43 R16.2
PIN31_H  (via drill 0.35)
  Top 0.152: v36.32,41.91 34.29,39.88 34.29,22.61 37.79,19.1 37.79,11.38 35.47,9.05 28.1,9.05 HC5.3
  Bottom 0.152: v36.32,41.91 37.51,43.1 38,43.1 38.8,43.9 R15.2
PIN32
  Bottom 0.152: HC5.2 26.67,15.24 26.67,40.76 30.79,44.88 30.79,47.8 32.51,49.53 41.66,49.53 42.67,50.55 42.67,52.05 43.13,52.5 44.69,52.5 45.96,53.77 CON1.32
PIN33  (via drill 0.35)
  Top 0.152: v37.85,22.35 37.85,32 38.61,32.77 38.61,33.73 v38.31,34.04
  Bottom 0.152: CON1.33 49.01,49.77 45.84,46.6 43.8,46.6 38.31,41.1 v38.31,34.04 | v37.85,22.35 37.85,15.24 39.67,13.41 39.67,11.03 R17.1 R18.2
PIN33_H
  Bottom 0.152: HC6.3 27.94,6.86 29.56,8.48 35.38,8.48 36.5,9.6 36.5,10.2 37.03,10.73 R17.2
PIN35  (via drill 0.35)
  Top 0.152: v38.86,18.03 38.86,22.86 38.61,23.11 38.61,31.5 39.62,32.51 v39.62,35.05
  Bottom 0.152: CON1.35 51.55,50.53 50.55,49.53 49.74,49.53 45.94,45.74 44.47,45.74 39.17,40.44 39.17,35.51 v39.62,35.05 | v38.86,18.03 38.86,15.49 41.91,12.45 41.91,6.81 41.25,6.15 R19.1 R20.2
PIN35_H
  Bottom 0.152: HC7.3 31.75,5.08 36.02,5.08 36.3,5.36 36.3,5.8 36.65,6.15 R19.2
PIN36  (via drill 0.35)
  Top 0.152: v35.56,25.91 v35.56,38.61
  Bottom 0.152: HC6.2 29.21,15.24 29.21,20.83 31.5,23.11 34.04,23.11 35.56,24.64 v35.56,25.91 | CON1.36 50.28,52.5 48.18,52.5 47.75,52.07 47.75,49.53 45.51,47.29 43.38,47.29 35.56,39.47 v35.56,38.61
PIN37  (via drill 0.35)
  Top 0.152: CON1.37 54.09,50.16 41.91,37.98 41.91,33.27 39.42,30.79 39.42,24.33 40.19,23.57 v40.19,22.91
  Bottom 0.152: R22.2 39.8,21.34 R21.1 39.3,21.34 39.79,21.83 39.79,22.51 v40.19,22.91
PIN37_H  (via drill 0.35)
  Top 0.152: HC8.3 34.16,7.49 36.7,7.49 40.39,11.18 40.39,16.76 v40.13,17.02
  Bottom 0.152: R21.2 40.13,19.14 v40.13,17.02
PIN38  (via drill 0.35)
  Top 0.152: v35.81,23.37 36.32,23.88 36.32,36.02 38.82,38.51 38.82,40.09 48.01,49.28 52.07,49.28 52.83,50.04 52.83,52.23 54.09,53.49 CON1.38
  Bottom 0.152: HC7.2 31.75,15.24 31.75,19.3 v35.81,23.37
PIN40  (via drill 0.35)
  Top 0.152: v37.08,38.61 37.08,39.62 47.75,50.29 47.75,54.86 48.51,55.63 55.47,55.63 56.63,54.47 CON1.40 | v36.83,21.59 36.83,23.11 37.08,23.37 37.08,32.77 v37.28,32.97
  Bottom 0.152: v36.83,21.59 v36.84,21.58 36.84,18.84 35.5,17.5 35.5,15.1 34.8,14.4 33.45,14.4 HC8.2 | v37.08,38.61 37.28,38.41 v37.28,32.97
PWM0
  Bottom 0.152: R1.1 53.93,23.53 PWM0.1
PWM1
  Bottom 0.152: R2.1 52.06,20.74 57.05,20.74 58.02,21.71 PWM1.1
RESET
  Top 1.27: U1.5-1 U1.5
  Bottom 0.152: U1.5 23.88,33.63 23.88,36.07 23.11,36.84 R3.2
SCL  (via drill 0.35)
  Top 0.152: CON1.5 13.45,50.45 13.08,50.08 13.08,40.9 11.45,39.27 11.45,31.05 13.5,29 20.7,29 21.7,28 21.7,25.05 U1.4 23.93,24.44 28.42,28.93 28.42,35.03 v30.23,36.83
  Top 1.27: U1.4 U1.4-1
  Bottom 0.152: v30.23,36.83 30.23,36.88 29.65,37.45 IC1.26 | CON1.5 13.45,49.52 1.78,37.85 1.78,12.95 12.95,1.78 48.68,1.78 50.04,3.13 50.04,10.48 CON3.SCL 49.55,14.62 50.42,15.49 59.94,15.49 61.72,17.27 61.72,29.72 59.18,32.26 52.83,32.26 51.76,33.33 U2.13
SDA  (via drill 0.35)
  Top 0.152: CON1.3 10.91,43.31 9.5,41.9 9.5,30.6 13.3,26.8 18.8,26.8 19.7,25.9 19.7,24.51 U1.3 | v31.24,37.85 31.5,37.59 31.5,27.18 24.38,20.07 20.32,20.07 19.77,20.62 U1.3-1
  Top 1.27: U1.3 U1.3-1
  Bottom 0.152: v31.24,37.85 30.99,38.1 30.23,38.1 30.22,38.1 IC1.27 | CON1.3 10.91,50.93 0.76,40.78 0.76,11.44 11.18,1.02 54.7,1.02 55.79,2.11 55.79,6.22 51.55,10.47 CON3.SDA 51.55,12.18 53.59,14.22 61.72,14.22 63.37,15.88 63.37,30.61 60.2,33.78 54.1,33.78 52.26,35.62 52.26,37.38 | 52.26,37.38 U2.12 | U2.11 52.76,37.88 52.26,37.38
TR_VCC
  Top 1.27: HC8.1 HC7.1 HC6.1 HC5.1 HC4.1 HC3.1 HC2.1 HC1.1 7.5,16.5 5.97,18.03 JP1.2
VOUT
  Top 1.27: U1.8 U1.8-1

### Text on the board
tPlace: 1 | Donkey Board | BNO055 | INT | GND | VOUT | RESET | VIN | GND | SDA | SCL | 0 | 1 | VCC | PWM | 1 | 1 | 2 | 3 | 4 | 5 | 6 | 7 | 8 | BEC | 5V | 3V3 | VCC | TRIG | 12 | 16 | 18 | 22 | 32 | 36 | 38 | 40 | SCL | SDA | 5V | GND | 11 | 13 | 15 | 29 | 31 | 33 | 35 | 37 | ECOH | GND | I2C1 | Revison 3.0.0
bPlace: CON1 | 1 | 1 | PCA9685 | CON2 | Revison 3.0.0 | DKTG-01G | S/N | #608
Document: #608 Donkey Board All Directions / Rev3.0.0 2024/05/27,21 2342 / DKTG-01G
tDocu: OLED | DIP8
_tNames: 0.96inch OLED | PCA9685PW | JST PA 4PIN